# EAGLE design SynchroClock (EAGLE 8.3.2)
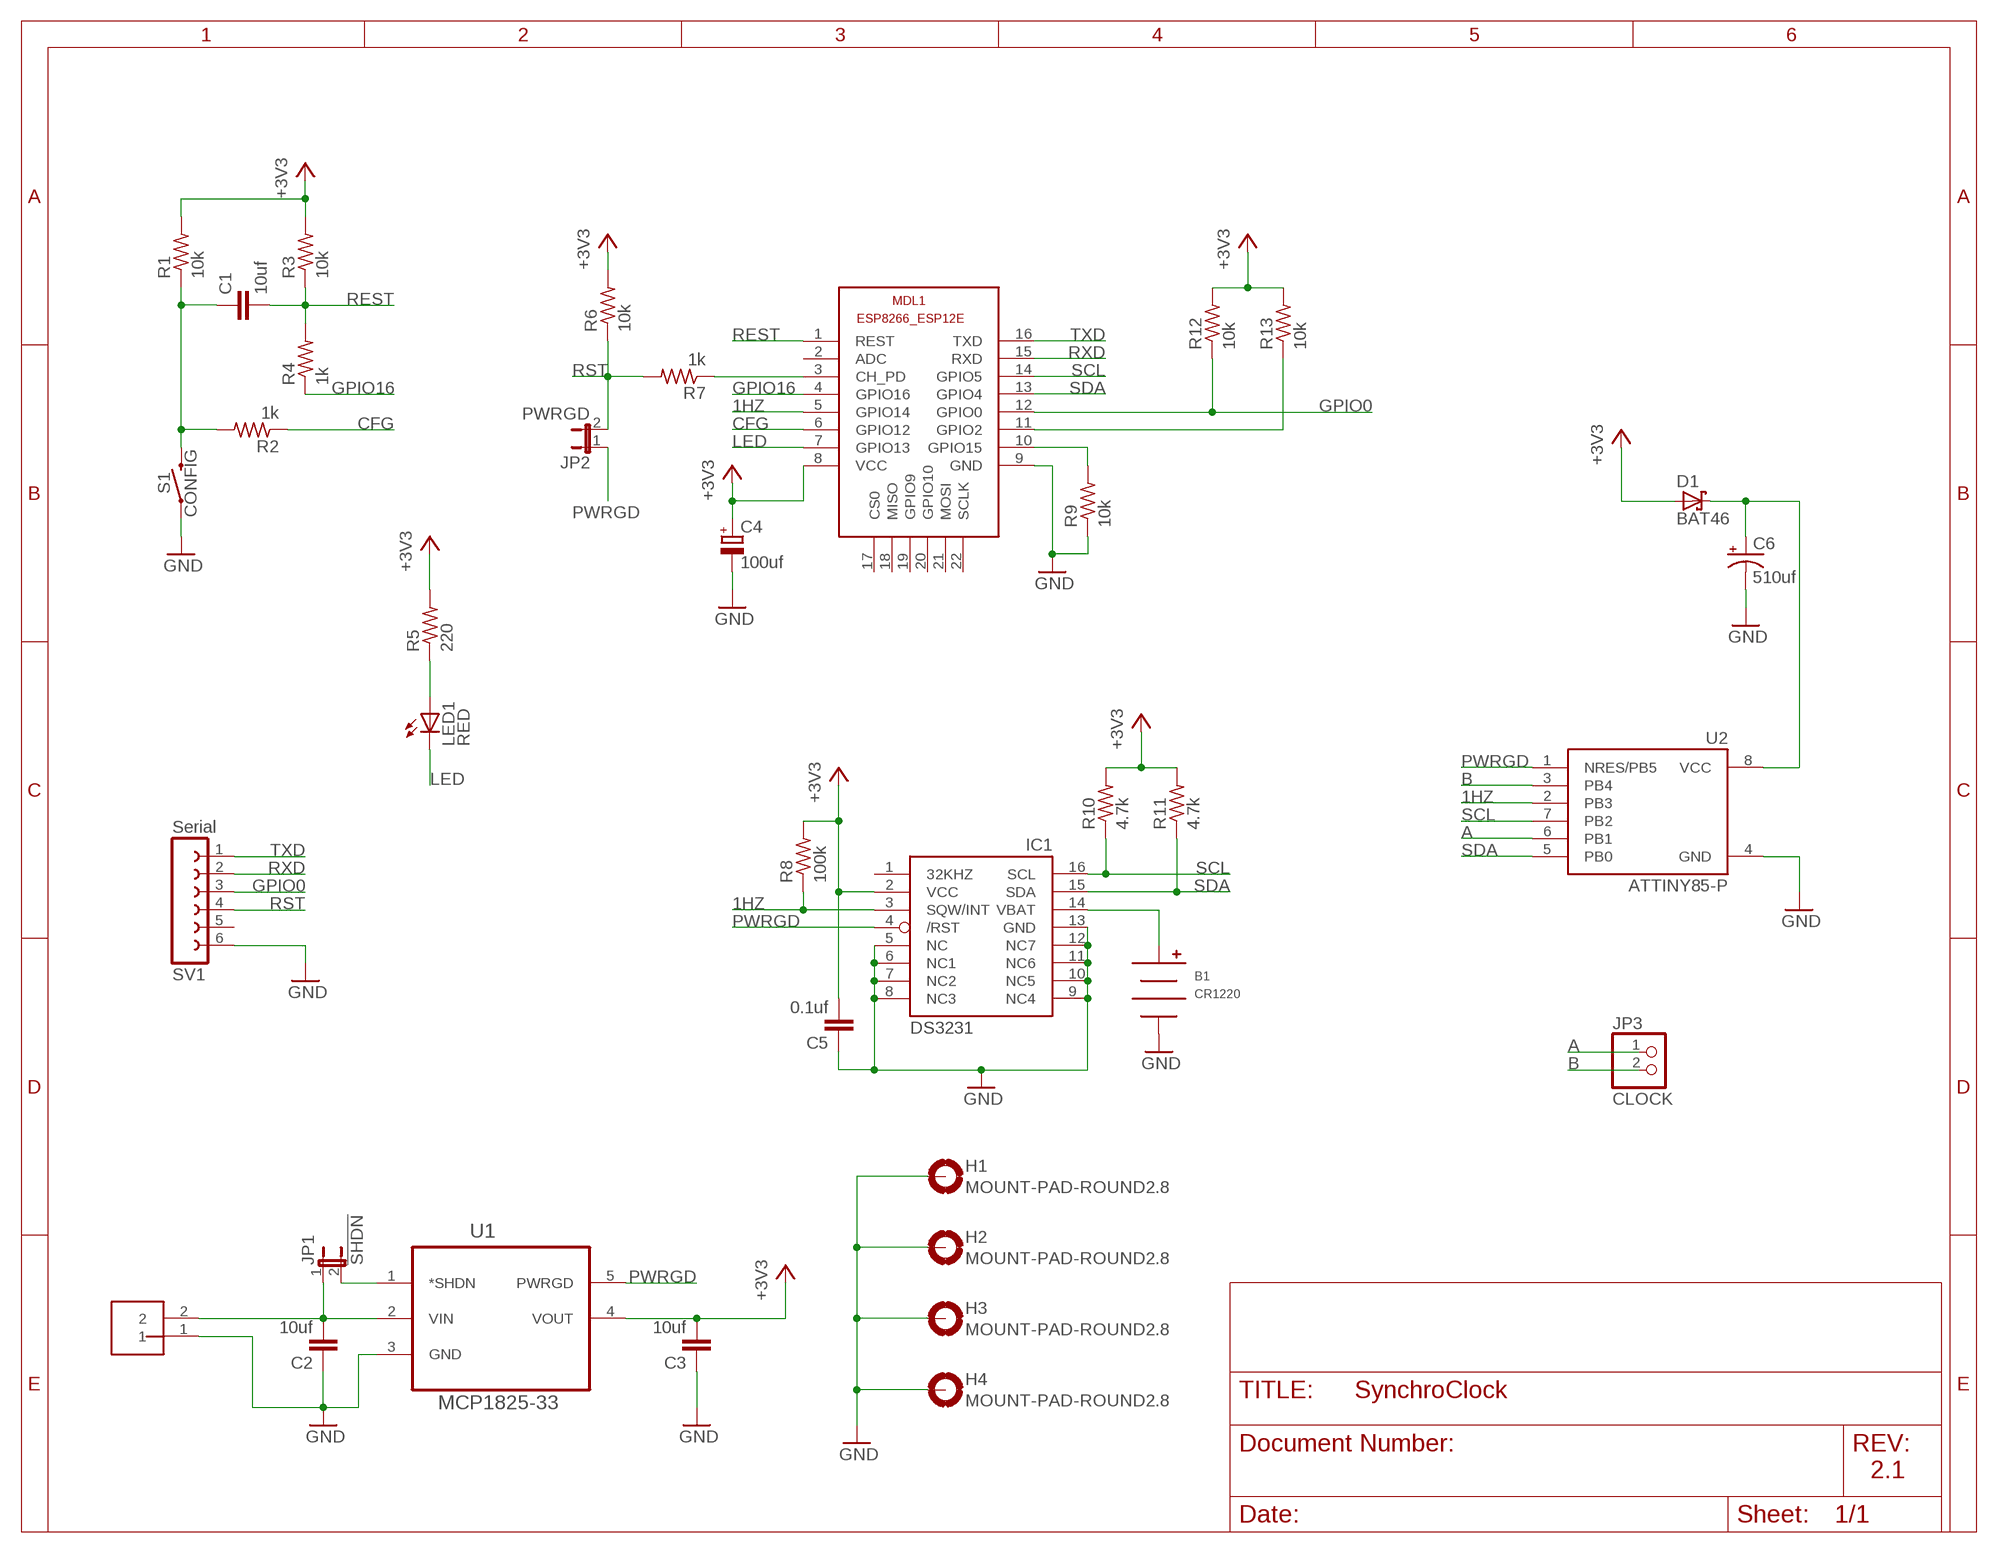
[diagram p0: schematic, sheet 1]
FRAME1 (FRAME_A_L): DATE: LAST_DATE_TIME

## Parts
B1  CR1220  CR1220-HOLDER  [HARWIN-CR1220]
C1  10uf  C5/2.5  [C5B2.5]
C2  10uf  C5/2.5  [C5B2.5]
C3  10uf  C5/2.5  [C5B2.5]
C4  100uf  CPOL-EUE2.5-5  [E2,5-5]
C5  0.1uf  C2.5/2  [C2.5-2]
C6  510uf  CPOL-USE3.5-8  [E3,5-8]
D1  BAT46  [DO35-10]
H1  MOUNT-PAD-ROUND2.8  [2,8-PAD]
H2  MOUNT-PAD-ROUND2.8  [2,8-PAD]
H3  MOUNT-PAD-ROUND2.8  [2,8-PAD]
H4  MOUNT-PAD-ROUND2.8  [2,8-PAD]
IC1  DS3231/SO  [SO16W]
J1  VIN  2_PIN_JST-XH  [2_PIN_JST-XH]
JP1  !SHDN  JUMPER-2PTH  [1X02]
JP2  PWRGD  JUMPER-2PTH  [1X02]
JP3  CLOCK  PINHD-1X2  [1X02]
LED1  RED  LED3MM  [LED3MM]
MDL1  ESP12E  ESP8266-12EESP8266-ESP12E  [ESP8266-ESP12E]
R1  10k  R-US_0204/2V  [0204V]
R2  1k  R-US_0204/2V  [0204V]
R3  10k  R-US_0204/2V  [0204V]
R4  1k  R-US_0204/2V  [0204V]
R5  220  R-US_0204/2V  [0204V]
R6  10k  R-US_0204/2V  [0204V]
R7  1k  R-US_0204/2V  [0204V]
R8  100k  R-US_0204/2V  [0204V]
R9  10k  R-US_0204/2V  [0204V]
R10  4.7k  R-US_0204/2V  [0204V]
R11  4.7k  R-US_0204/2V  [0204V]
R12  10k  R-US_0204/2V  [0204V]
R13  10k  R-US_0204/2V  [0204V]
S1  CONFIG  MOMENTARY-SWITCH-SPST-PTH-6.0MM  [TACTILE_SWITCH_PTH_6.0MM]
SV1  Serial  FE06-1  [FE06]
U1  MCP1825-33  MCP1825-3302E/AT  [TO170P482X1024X3124-5P]
U2  ATTINY85-P  [PDIP08_300MIL]

## Nets
1HZ: IC1.3(SQW/INT) MDL1.5(GPIO14) R8.1 U2.2(PB3)
!SHDN: JP1.2 U1.1(*SHDN)
+3V3 [power]: C3.2 C4.+ C5.2 D1.A IC1.2(VCC) MDL1.8(VCC) R1.2 R3.2 R5.2 R6.2 R8.2 R10.2 R11.2 R12.2 R13.2 U1.4(VOUT)
+5V [power]: C2.2 J1.2 JP1.1 U1.2(VIN)
A [power]: JP3.1 U2.6(PB1)
ATVCC [power]: C6.+ D1.C U2.8(VCC)
B [power]: JP3.2 U2.3(PB4)
CFG: MDL1.6(GPIO12) R2.1
CH_PD: MDL1.3(CH_PD) R7.1
GND [power]: B1.NEG C2.1 C3.1 C4.- C5.1 C6.- H1.B2,8(MOUNT) H2.B2,8(MOUNT) H3.B2,8(MOUNT) H4.B2,8(MOUNT) IC1.5(NC) IC1.6(NC1) IC1.7(NC2) IC1.8(NC3) IC1.9(NC4) IC1.10(NC5) IC1.11(NC6) IC1.12(NC7) IC1.13(GND) J1.1 MDL1.9(GND) R9.1 S1.1 SV1.6 U1.3(GND) U2.4(GND)
GPIO0: MDL1.12(GPIO0) R12.1 SV1.3
GPIO2: MDL1.11(GPIO2) R13.1
GPIO15: MDL1.10(GPIO15) R9.2
GPIO16: MDL1.4(GPIO16) R4.1
LED: LED1.K(C) MDL1.7(GPIO13)
N$1: C1.1 R1.1 R2.2 S1.3
N$6: LED1.A R5.1
PWRGD: IC1.4(/RST) JP2.1 U1.5(PWRGD) U2.1(NRES/PB5)
REST: C1.2 MDL1.1(REST) R3.1 R4.2
RST: JP2.2 R6.1 R7.2 SV1.4
RXD: MDL1.15(RXD) SV1.2
SCL: IC1.16(SCL) MDL1.14(GPIO5) R10.1 U2.7(PB2)
SDA: IC1.15(SDA) MDL1.13(GPIO4) R11.1 U2.5(PB0)
TXD: MDL1.16(TXD) SV1.1
VBAT [power]: B1.POS IC1.14(VBAT)
Unconnected: IC1.1(32KHZ) MDL1.2(ADC) MDL1.17(CS0) MDL1.18(MISO) MDL1.19(GPIO9) MDL1.20(GPIO10) MDL1.21(MOSI) MDL1.22(SCLK) SV1.5

## Notes on the sheet
- 2.1

## Library data of the parts
B1 = SynchroClock:CR1220-HOLDER
C1-C3 C5 = capacitor-wima:C: CAPACITOR naming: grid - package width
C4 = rcl:CPOL-EU: POLARIZED CAPACITOR, European symbol
C6 = rcl:CPOL-US: POLARIZED CAPACITOR, American symbol
D1 = SynchroClock:BAT46: Schottky Diode barrier diode
H1-H4 = holes:MOUNT-PAD-ROUND: MOUNTING PAD, round
IC1 = SynchroClock:DS3231
J1 = SynchroClock:2_PIN_JST-XH: Corrected for XH 2 pin dmf 4.10.15 Source info: http://www.jst-mfg.com/product/pdf/eng/eXH.pdf Note: pin spacing is 2.5 mm Note: pins are 0.64 mm square cross section. This means the pin diagonal is 0.905 mm. Hole diameter spec'd by jst is 0.9 mm; hole diameter used here is 1.0 mm
JP1 JP2 = SynchroClock:JUMPER-2: Jumper Basic 0.1" spaced jumper. Use with breakaway headers.
JP3 = pinhead:PINHD-1X2: PIN HEADER
LED1 = led:LED: LED OSRAM: - CHIPLED LG R971, LG N971, LY N971, LG Q971, LY Q971, LO R971, LY R971 LH N974, LH R974 LS Q976, LO Q976, LY Q976 LO Q996 - Hyper CHIPLED LW Q18S LB Q993, LB Q99A, LB R99A - SideLED LS A670, LO A670, LY A670, LG A670, LP A670 LB A673, LV A673, LT A673, LW A673 LH A674 LY A675 LS A676, LA A676, LO A676, LY A676, LW A676 LS A679, LY A679, LG A679 - Hyper Micro SIDELED® LS Y876, LA Y876, LO Y876, LY Y876 LT Y87S - SmartLED LW L88C, LW L88S LB L89C, LB L89S, LG L890 LS L89K, LO L89K, LY L89K LS L896, LA L896, LO L896, LY L896 - TOPLED LS T670, LO T670, LY T670, LG T670, LP T670 LSG T670, LSP T670, LSY T670, LOP T670, LYG T670 LG T671, LOG T671, LSG T671 LB T673, LV T673, LT T673, LW T673 LH T674 LS T676, LA T676, LO T676, LY T676, LB T676, LH T676, LSB T676, LW T676 LB T67C, LV T67C, LT T67C, LS T67K, LO T67K, LY T67K, LW E67C LS E67B, LA E67B, LO E67B, LY E67B, LB E67C, LV E67C, LT E67C LW T67C LS T679, LY T679, LG T679 LS T770, LO T770, LY T770, LG T770, LP T770 LB T773, LV T773, LT T773, LW T773 LH T774 LS E675, LA E675, LY E675, LS T675 LS T776, LA T776, LO T776, LY T776, LB T776 LHGB T686 LT T68C, LB T68C - Hyper Mini TOPLED® LB M676 - Mini TOPLED Santana® LG M470 LS M47K, LO M47K, LY M47K Source: http://www.osram.convergy.de LUXEON: - LUMILED® LXK2-PW12-R00, LXK2-PW12-S00, LXK2-PW14-U00, LXK2-PW14-V00 LXK2-PM12-R00, LXK2-PM12-S00, LXK2-PM14-U00 LXK2-PE12-Q00, LXK2-PE12-R00, LXK2-PE12-S00, LXK2-PE14-T00, LXK2-PE14-U00 LXK2-PB12-K00, LXK2-PB12-L00, LXK2-PB12-M00, LXK2-PB14-N00, LXK2-PB14-P00, LXK2-PB14-Q00 LXK2-PR12-L00, LXK2-PR12-M00, LXK2-PR14-Q00, LXK2-PR14-R00 LXK2-PD12-Q00, LXK2-PD12-R00, LXK2-PD12-S00 LXK2-PH12-R00, LXK2-PH12-S00 LXK2-PL12-P00, LXK2-PL12-Q00, LXK2-PL12-R00 Source: www.luxeon.com KINGBRIGHT: KA-3528ASYC Source: www.kingbright.com
MDL1 = SynchroClock:ESP8266-12E: ESP8266-12E with additional I/O and GPIO04/05 corrected The author cannot warrant that this library is free from error or will meet your specific requirements. Created by PuceBaboon.com. Komagane, Nagano, JAPAN
R1 = rcl:R-US_: RESISTOR, American symbol
R2-R13 = resistor:R-US_: RESISTOR, American symbol
S1 = SparkFun-Switches:MOMENTARY-SWITCH-SPST: Momentary Switch (Pushbutton) - SPST Normally-open (NO) SPST momentary switches (buttons, pushbuttons). Variants PTH-12MM - 12mm square, through-hole Momentary Pushbutton Switch - 12mm Square <https://www.sparkfun.com/products/9190> (COM-09190) PTH-6.0MM, PTH-6.0MM-KIT - 6.0mm square, through-hole Mini Pushbutton Switch <https://www.sparkfun.com/products/97> (COM-00097) KIT package intended for soldering kit's - only one side of pads' copper is exposed. PTH-RIGHT-ANGLE-KIT - Right-angle, through-hole Right Angle Tactile Button <https://www.sparkfun.com/products/10791> - Used on SparkFun BigTime Watch Kit <https://www.sparkfun.com/products/11734> SMD-12MM - 12mm square, surface-mount Tactile Button - SMD (12mm) <https://www.sparkfun.com/products/12993> (COM-12993) Used on SparkFun PicoBoard <https://www.sparkfun.com/products/11888> SMD-4.5MM - 4.5mm Square Trackball Switch Used on SparkFun Blackberry Trackballer Breakout <https://www.sparkfun.com/products/13169> SMD-4.6MMX2.8MM - 4.60mm x 2.80mm, surface mount Used on SparkFun SAMD21 Mini Breakout <https://www.sparkfun.com/products/13664> SMD-5.2MM, SMD-5.2-REDUNDANT - 5.2mm square, surface-mount Mini Pushbutton Switch - SMD <https://www.sparkfun.com/products/8720> (COM-08720) Used on Arduino Pro Mini <https://www.sparkfun.com/products/11114> REDUNDANT package connects both switch circuits together SMD-6.0X3.5MM - 6.0 x 3.5mm, surface mount Momentary Reset Switch SMD <https://www.sparkfun.com/products/8229> (COM-08229) SMD-6.2MM-TALL - 6.2mm square, surface mount Tactile Button - SMD (6mm) <https://www.sparkfun.com/products/12992> Used on SparkFun Digital Sandbox <https://www.sparkfun.com/products/12651> SMD-RIGHT-ANGLE - Right-angle, surface mount Used on SparkFun Block for Intel® Edison - Arduino <https://www.sparkfun.com/products/13036>; PROD_ID: SWCH-08441; SF_SKU: COM-00097
SV1 = con-lsta:FE06-1: FEMALE HEADER; OC_FARNELL: unknown; OC_NEWARK: unknown
U1 = SynchroClock:MCP1825-3302E/AT: IC, LDO, ADJ, 500MA; AVAILABILITY: Good; DESCRIPTION: LDO Regulator Pos 3.3V 0.5A 5-Pin%285%2BTab%29 TO-220; MF: Microchip; MP: MCP1825-0802E/AT; PACKAGE: TO-220 Microchip; PRICE: 0.72 USD
U2 = SynchroClock:ATTINY85*: ATMEL ATtiny 85 Packages: P = PDIP 08 30mil S = SOIC 08 EIAJ 208mil Technologies Note: for complete ordering code (temp. range, finish, tape&reel etc.) see www.atmel.com • Supply Voltage: V = (1.8…5.5)V | [blank] = (2.7…5.5)V • Speed: 10 = 10 MHz | 20 = 20 MHz Author: Dipl.-Ing. FH Rainer Bayer HHN Hochschule Heilbronn (Heilbronn University), rainer.bayer@hs-heilbronn.de Ingenieurbüro ing-rb, mail@ing-rb.de

## Net classes
1 power: width 0.508 mm

## Board
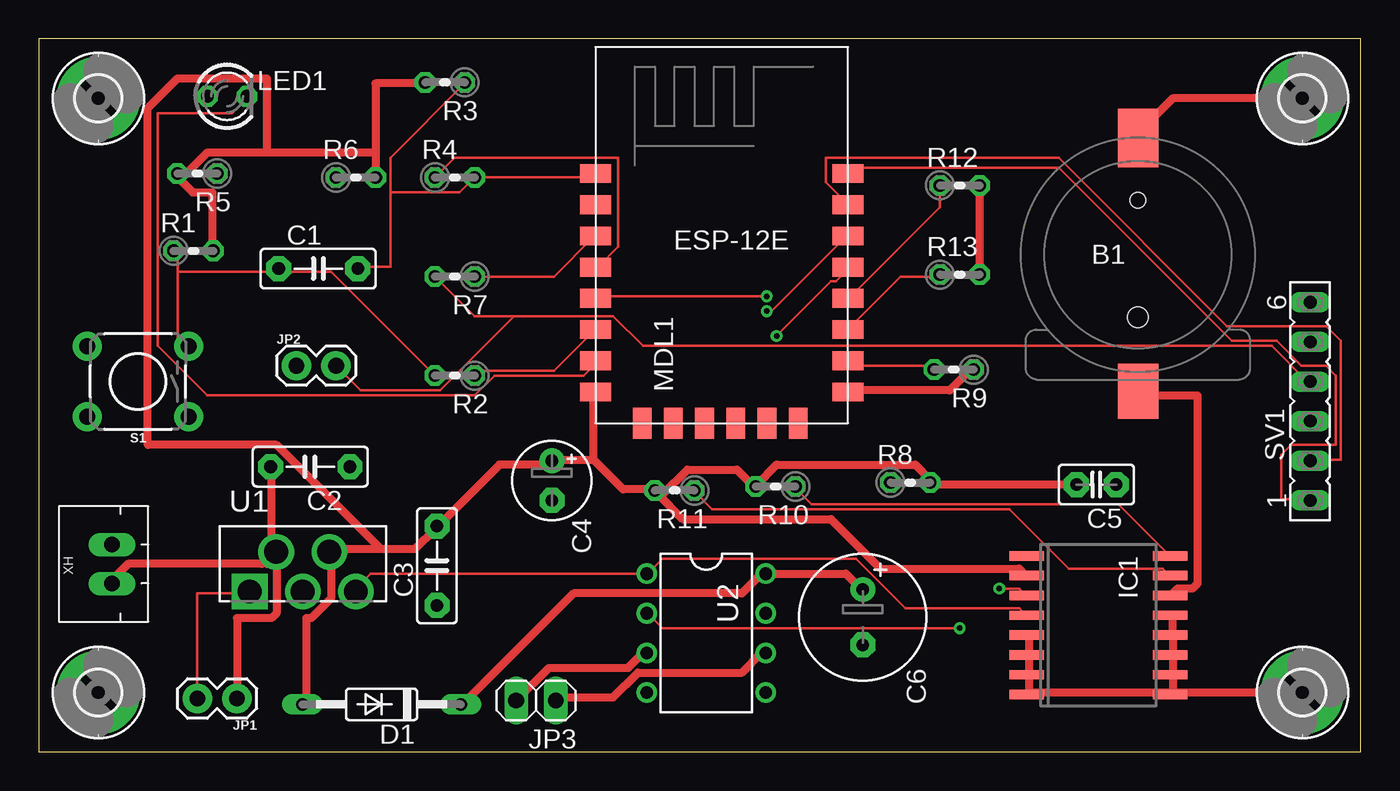
[diagram p1: board, top side]
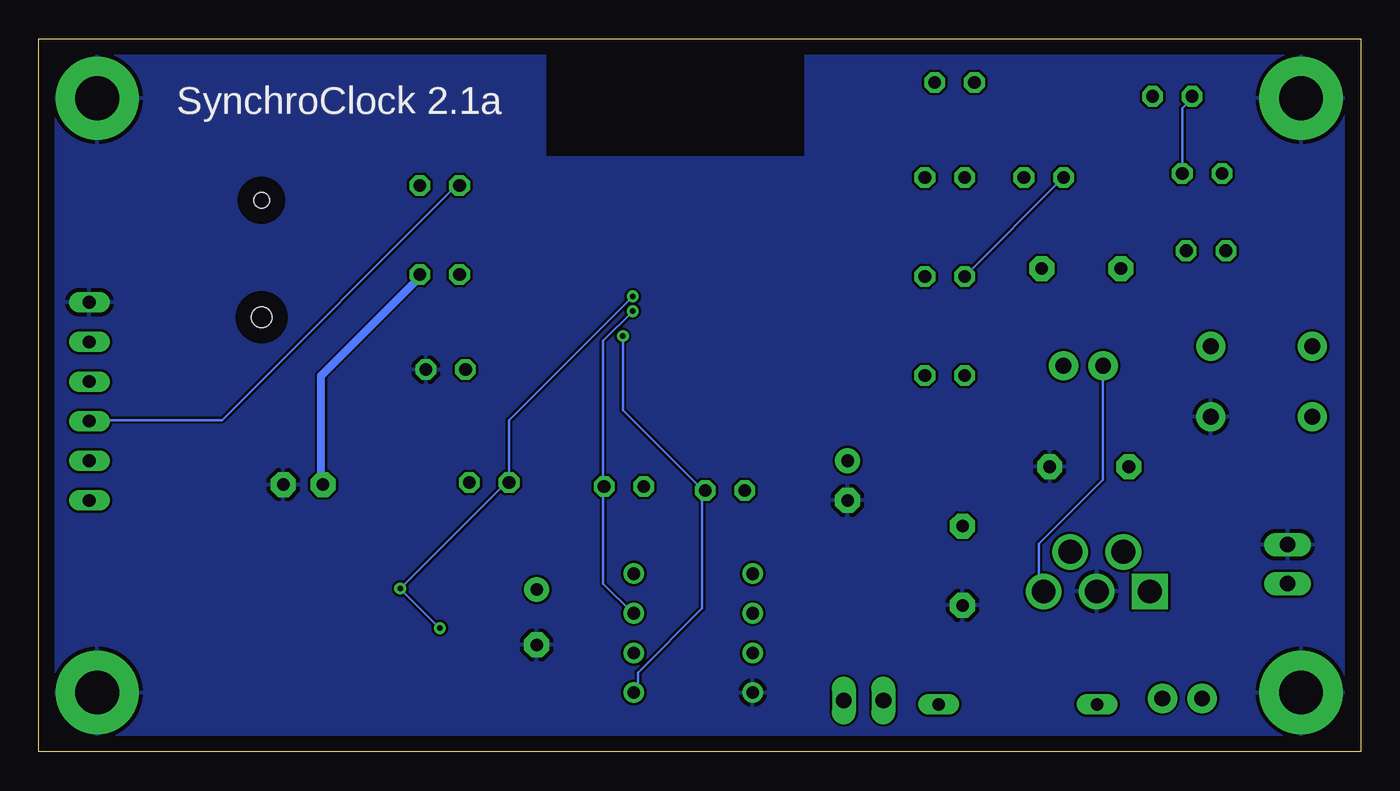
[diagram p2: board, bottom side, seen from below]

Size 84.76 x 45.71 mm. Coordinates in mm from the lower left corner, seen from the top.
Outline: 0,0 84.76,0 84.76,45.71 0,45.71 0,0
Copper layers (1*16): Top 0.035mm / dielectric 1.5mm / Bottom 0.035mm
Design rules "default *": minimum track width 6mil, minimum drill 0.35mm, track to track 6mil, track to pad 6mil, pad to pad 6mil, via to via 6mil, smd to smd 6mil, copper to edge 40mil, drill to drill 6mil, minimum pad ring 10mil, minimum via ring 8mil, stop-mask expansion 4mil, vias tented up to drill 0mil, thermal gap 10mil

### Footprints (pad centres in the part's own frame; a part is rotated, then mirrored left to right if it is on the bottom)
HARWIN-CR1220 = smd 2.6 x 3.75: NEG 0,7.5 | smd 2.6 x 3.5: POS 0,-8.75 | hole 1: 0,3.5 | hole 1.3: 0,-4
C5B2.5 = drill 0.813 pad 1.6 octagon: 1 -2.54,0; 2 2.54,0
E2,5-5 = drill 0.813 pad 1.6: + -1.27,0 | drill 0.813 pad 1.6 octagon: - 1.27,0
C2.5-2 = drill 0.813 pad 1.6 octagon: 1 -1.27,0; 2 1.27,0
E3,5-8 = drill 0.813 pad 1.6: + -1.778,0 | drill 0.813 pad 1.6 octagon: - 1.778,0
DO35-10 = drill 0.813 long: A 5.08,0; C -5.08,0
2,8-PAD = drill 2.8 pad 5.334: B2,8 0,0
SO16W = smd 0.6 x 2.2: 1 -4.445,-4.6; 2 -3.175,-4.6; 3 -1.905,-4.6; 4 -0.635,-4.6; 5 0.635,-4.6; 6 1.905,-4.6; 7 3.175,-4.6; 8 4.445,-4.6; 9 4.445,4.6; 10 3.175,4.6; 11 1.905,4.6; 12 0.635,4.6; 13 -0.635,4.6; 14 -1.905,4.6; 15 -3.175,4.6; 16 -4.445,4.6
2_PIN_JST-XH = drill 1 long: 1 2.45,3.4; 2 4.95,3.4
1X02 = drill 1.016 pad 1.88: 1 0,0; 2 2.54,0
1X02' = drill 1.016 long: 1 -1.27,0; 2 1.27,0
LED3MM = drill 0.813 octagon: A -1.27,0; K 1.27,0
ESP8266-ESP12E = smd 2 x 1.2: 1 -7.62,5.84; 2 -7.62,3.84; 3 -7.62,1.84; 4 -7.62,-0.16; 5 -7.62,-2.16; 6 -7.62,-4.16; 7 -7.62,-6.16; 8 -7.62,-8.16; 9 8.58,-8.16; 10 8.58,-6.16; 11 8.58,-4.16; 12 8.58,-2.16; 13 8.58,-0.16; 14 8.58,1.84; 15 8.58,3.84; 16 8.58,5.84 | smd 1.2 x 2: 17 -4.62,-10.16; 18 -2.62,-10.16; 19 -0.62,-10.16; 20 1.38,-10.16; 21 3.38,-10.16; 22 5.38,-10.16
0204V = drill 0.813 octagon: 1 -1.27,0; 2 1.27,0
TACTILE_SWITCH_PTH_6.0MM = drill 1.016 pad 1.88: 1 -3.251,2.261; 2 3.251,2.261; 3 -3.251,-2.261; 4 3.251,-2.261
FE06 = drill 0.813 long: 1 -6.35,0; 2 -3.81,0; 3 -1.27,0; 4 1.27,0; 5 3.81,0; 6 6.35,0
TO170P482X1024X3124-5P = drill 1.524 square: 1 -6.807,-3.556 | drill 1.524: 2 -5.105,-1.016; 3 -3.404,-3.556; 4 -1.702,-1.016; 5 0,-3.556
PDIP08_300MIL = drill 0.813: 1 -3.81,-3.81; 2 -1.27,-3.81; 3 1.27,-3.81; 4 3.81,-3.81; 5 3.81,3.81; 6 1.27,3.81; 7 -1.27,3.81; 8 -3.81,3.81

### Placement (x,y rotation side)
B1  70.48,31.88 0 top
C1  17.91,30.99 0 top
C2  17.4,18.29 180 top
C3  25.53,11.94 90 top
C4  32.89,17.4 270 top
C5  67.82,17.14 180 top
C6  52.83,8.64 270 top
D1  21.97,3.05 180 top
H1  3.81,3.81 0 top
H2  81.03,3.81 0 top
H3  81.03,41.91 0 top
H4  3.81,41.91 0 top
IC1  67.94,8.13 270 top
J1  1.27,15.75 270 top
JP1  12.7,3.43 180 top
JP2  16.51,24.77 0 top
JP3  CLOCK  [1X02']  31.88,3.3 180 top
LED1  12.06,42.04 0 top
MDL1  43.31,31.24 0 top
R1  9.91,32.13 0 top
R2  26.67,24.13 180 top
R3  26.04,42.93 180 top
R4  26.67,36.83 0 top
R5  10.16,37.08 180 top
R6  20.32,36.83 0 top
R7  26.67,30.48 180 top
R8  55.88,17.27 0 top
R9  58.67,24.51 180 top
R10  47.24,17.02 180 top
R11  40.77,16.76 180 top
R12  59.05,36.32 0 top
R13  59.05,30.61 0 top
S1  6.35,23.75 180 top
SV1  81.53,22.48 90 top
U1  20.32,13.84 0 top
U2  42.8,7.62 270 top

### Tracks (layer width: path | path; a pad name or v marks a point on that pad's centre or on a via)
1HZ  (via drill 0.35)
  Top 0.152: v46.67,29.21 35.88,29.21 MDL1.5 | v61.59,10.48 62.87,10.48 63.18,10.16 IC1.3 | v59.05,7.94 40.01,7.94 39.05,8.89 U2.2
  Bottom 0.152: v46.67,29.21 54.61,21.27 54.61,17.46 | 54.61,17.46 v61.59,10.48 v59.05,7.94 | 54.61,17.46 R8.1
!SHDN
  Top 0.152: JP1.2 10.16,10.16 13.34,10.16 U1.1
+3V3
  Top 0.508: R12.2 R13.2 | C5.2 57.15,17.14 R8.2 57.15,17.46 56.2,18.41 47.31,18.41 46.04,17.14 R10.2 45.72,17.14 44.77,18.1 41.59,18.1 40.01,16.51 R11.2 | R1.2 11.11,32.38 11.11,35.88 9.84,35.88 8.89,36.83 R5.2 9.21,36.83 10.79,38.42 14.61,38.42 | 21.59,38.42 21.59,42.86 24.77,42.86 R3.2 | 21.59,38.42 R6.2 | 21.59,38.42 14.61,38.42 | D1.A 17.14,3.17 17.14,8.57 17.46,8.57 18.73,9.84 18.73,12.7 U1.4 18.73,13.02 21.91,13.02 | 21.91,13.02 24.13,13.02 25.4,14.29 C3.2 25.72,14.61 29.53,18.41 32.7,18.41 C4.+ 33.02,18.73 35.56,18.73 | 35.56,18.73 35.56,22.86 MDL1.8 | IC1.2 63.18,11.43 62.87,11.75 53.98,11.75 50.8,14.92 41.27,14.92 39.69,16.51 R11.2 | 35.56,18.73 37.47,16.83 39.37,16.83 R11.2 | 14.61,38.42 14.61,43.18 8.89,43.18 6.99,41.27 6.99,19.68 15.24,19.68 21.91,13.02
  Bottom 0.508: R13.2 60.33,30.48 66.67,24.13 66.67,17.14 C5.2
+5V
  Top 0.508: J1.2 4.76,11.11 5.71,12.06 14.29,12.06 14.92,12.7 U1.2 | C2.2 14.92,18.1 14.92,13.02 U1.2 | JP1.1 12.7,8.57 14.92,8.57 15.24,8.89 15.24,12.06 14.61,12.06 U1.2
A
  Top 0.508: U2.6 46.35,6.35 45.09,5.08 38.42,5.08 36.83,3.49 33.34,3.49 JP3.1
ATVCC
  Top 0.508: D1.C 27.3,3.17 34.29,10.16 45.09,10.16 46.35,11.43 U2.8 51.75,11.43 52.7,10.48 C6.+
B
  Top 0.508: JP3.2 32.7,5.4 37.78,5.4 38.73,6.35 U2.3
CFG
  Top 0.152: R2.1 28.26,24.45 33.02,24.45 35.56,26.99 MDL1.6
CH_PD
  Top 0.152: R7.1 33.02,30.48 35.56,33.02 MDL1.3
GND
  Top 0.508: 63.5,3.81 63.5,4.76 IC1.7 63.5,5.08 63.5,6.03 IC1.6 63.5,6.35 63.5,7.3 IC1.5 | 72.71,3.81 72.71,4.76 IC1.10 72.71,5.08 72.71,6.03 IC1.11 72.71,6.35 72.71,7.3 IC1.12 72.71,7.62 72.71,8.57 IC1.13 | 63.5,3.81 72.39,3.81 IC1.9 72.71,3.81 | 63.5,3.81 IC1.8 | MDL1.9 52.07,23.18 58.42,23.18 59.69,24.45 R9.1 | H3.B2,8 72.71,41.91 70.48,39.69 B1.NEG | H2.B2,8 72.71,3.81
  pour Bottom: 0,45.72 84.71,45.72 84.71,0 0,0
GPIO0
  Top 0.152: R12.1 57.78,34.92 52.07,29.21 MDL1.12
  Bottom 0.152: SV1.3 81.28,21.27 73.03,21.27 57.78,36.51 R12.1
GPIO2
  Top 0.152: MDL1.11 52.07,27.3 55.24,30.48 57.78,30.48 R13.1
GPIO15
  Top 0.152: MDL1.10 52.07,24.77 57.15,24.77 R9.2
GPIO16
  Top 0.152: R4.1 26.67,38.1 37.15,38.1 37.15,32.38 35.88,31.11 MDL1.4
LED
  Top 0.152: MDL1.7 35.56,24.77 34.92,24.13 29.21,24.13 27.94,22.86 10.79,22.86 7.62,26.04 7.62,40.96 12.38,40.96 13.34,41.91 LED1.K
N$1
  Top 0.152: 8.89,30.8 8.89,26.04 9.53,26.04 S1.3 | 8.89,30.8 8.89,32.07 R1.1 | R2.2 18.73,30.8 15.56,30.8 C1.1 15.24,30.8 8.89,30.8
N$6
  Bottom 0.152: R5.1 11.43,41.27 10.79,41.91 LED1.A
PWRGD
  Top 0.152: IC1.4 63.18,8.89 62.87,9.21 55.56,9.21 52.39,12.38 40.01,12.38 39.05,11.43 U2.1 21.27,11.43 20.32,10.48 U1.5
  Bottom 0.152: JP2.1 16.51,17.46 20.64,13.34 20.64,10.79 20.32,10.48 U1.5
REST
  Top 0.152: MDL1.1 35.56,36.83 R4.2 26.99,35.88 22.54,35.88 | 22.54,35.88 22.54,31.11 20.64,31.11 C1.2 | 22.54,35.88 22.54,38.1 27.3,42.86 R3.1
RST
  Top 0.152: 30.48,27.94 27.94,27.94 R7.2 | 30.48,27.94 36.83,27.94 38.73,26.04 79.06,26.04 81.28,23.81 SV1.4 | JP2.2 20.64,23.18 25.72,23.18 30.48,27.94
  Bottom 0.152: R7.2 R6.1
RXD
  Top 0.152: MDL1.15 51.75,35.24 50.48,36.51 50.48,38.1 65.41,38.1 76.2,27.3 82.55,27.3 83.5,26.35 83.5,18.73 81.6,18.73 SV1.2
SCL  (via drill 0.35)
  Top 0.152: v46.67,28.26 46.99,28.26 51.75,33.02 MDL1.14 | IC1.16 72.39,12.7 69.22,15.88 49.53,15.88 48.58,16.83 R10.1
  Bottom 0.152: v46.67,28.26 48.58,26.35 48.58,17.14 R10.1 48.58,16.83 48.58,10.79 46.67,8.89 U2.7
SDA  (via drill 0.35)
  Top 0.152: v47.31,26.67 50.8,30.16 51.12,30.16 51.75,30.8 MDL1.13 | IC1.15 72.39,11.43 72.07,11.75 66.04,11.75 62.23,15.56 43.18,15.56 42.23,16.51 R11.1
  Bottom 0.152: v47.31,26.67 47.31,21.91 42.23,16.83 R11.1 42.23,16.51 42.23,9.21 46.35,5.08 46.35,3.81 U2.5
TXD
  Top 0.152: MDL1.16 52.07,37.15 52.39,37.47 65.41,37.47 76.52,26.35 79.38,26.35 80.96,24.77 82.55,24.77 83.19,24.13 83.19,19.68 80.33,19.68 79.69,19.05 79.69,16.19 81.28,16.19 SV1.1
VBAT
  Top 0.508: IC1.14 72.71,10.16 73.03,10.48 73.98,10.48 74.3,10.79 74.3,22.86 70.48,22.86 B1.POS

### Text on the board
bPlace: SynchroClock 2.1a